# EAGLE design Coll-Interface (EAGLE 9.6.2)
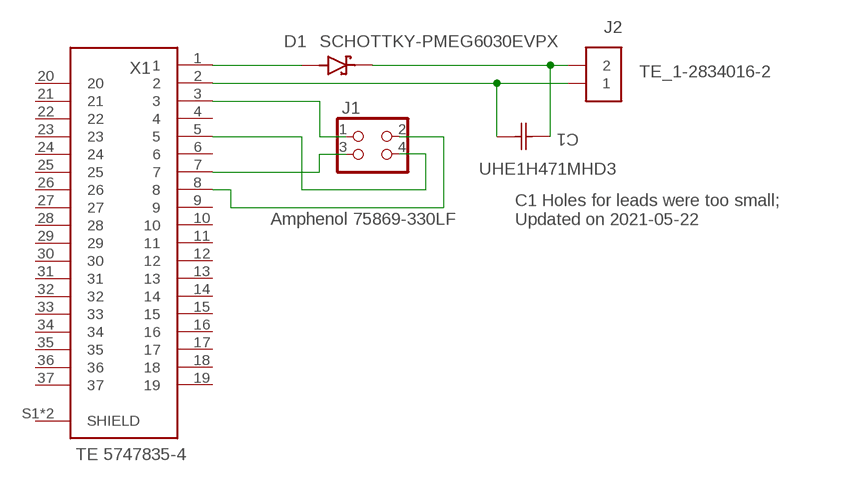
[diagram p0: schematic, sheet 1]

## Parts
C1  UHE1H471MHD3  ELECTROLYTIC_UHE1H471MHD3  [U1-EE_NCH]
D1  SCHOTTKY-PMEG6030EVPX  [DIO_PMEG6030EVPX]
J1  Amphenol 75869-330LF  PINHD-2X2AMP-75869-130LF  [2X02-SHROUD]
J2  TE_1-2834016-2  TERMINAL_BLOCK_2PIN_1-2834016-2  [TE_1-2834016-2]
X1  TE 5747835-4  DE-37-TE-CONNECTIVITY-5747835-4  [TE_5747835-4]

## Nets
+24V-FROM-SPECMECH: D1.2(A) X1.1
+24V-TO-ROBOCLAW: C1.1 D1.1(K) J2.2.1 J2.2.2
GND-ROBOCLAW: C1.2 J2.1.1 J2.1.2 X1.2
GND-SPECMECH: J1.4 X1.5
ROBO-RX: J1.1 X1.3
ROBO-TX: J1.3 X1.7
VCC-SPECMECH: J1.2 X1.8
Unconnected: X1.4 X1.6 X1.9 X1.10 X1.11 X1.12 X1.13 X1.14 X1.15 X1.16 X1.17 X1.18 X1.19 X1.20 X1.21 X1.22 X1.23 X1.24 X1.25 X1.26 X1.27 X1.28 X1.29 X1.30 X1.31 X1.32 X1.33 X1.34 X1.35 X1.36 X1.37 X1.S1(SHIELD) X1.S2(SHIELD)

## Notes on the sheet
- C1 Holes for leads were too small;
  Updated on 2021-05-22

## Library data of the parts
C1 = AUmlib:ELECTROLYTIC_UHE1H471MHD3; BUILT_BY: EMA_UL_Team; MANUFACTURER_PART_NUMBER: UHE1H471MHD3; SOURCELIBRARY: Nichicon_2014-12-31; VENDOR: Nichicon
D1 = AUmlib:SCHOTTKY-PMEG6030EVPX: PMEG6030 Series 60 V 3 A Surface Mount Schottky Barrier Rectifier - SOD-128; DESCRIPTION: Diode Schottky 60V 3A Surface Mount SOD-128/CFP5; DIGI-KEY_PART_NUMBER: 1727-1349-1-ND; MF: Nexperia USA; MP: PMEG6030EVPX; PACKAGE: CFP5-2 Nexperia USA Inc.; PURCHASE-URL: https://pricing.snapeda.com/search/part/PMEG6030EVPX/?ref=eda
J1 = AUmlib:PINHD-2X2: PIN HEADER
J2 = AUmlib:TERMINAL_BLOCK_2PIN_1-2834016-2: PCB Terminal Blocks, Receptacle, Wire-to-Board, 2 Positions, 1 Rows, Side Wire Entry Angle, 26 – 20AWG Wire Size, 6A Current Rating (Max), 300 VAC; COMMENT: 1-2834016-2; DESCRIPTION: Conn PC Terminal Block 2 POS 2.54mm Solder ST Thru-Hole 6A/Contact Box/Carton; DIGI-KEY_PART_NUMBER: A123829-ND; EU_ROHS_COMPLIANCE: Compliant; MF: TE Connectivity; MP: 1-2834016-2; PACKAGE: None; PURCHASE-URL: https://pricing.snapeda.com/search/part/1-2834016-2/?ref=eda
X1 = AUmlib:DE-37-TE-CONNECTIVITY-5747835-4: 37 MSFL PLUG RA 590 (IN,FM,BL); CENTERLINE_PITCH: 2.74 mm[.108 in]; COMMENT: 5747835-4; DESCRIPTION: 37 MSFL PLUG RA 590 (IN,FM,BL); DIGI-KEY_PART_NUMBER: A32082-ND; MF: TE Connectivity; MP: 5747835-4; NUMBER_OF_POSITIONS: 37; PACKAGE: None; PRODUCT_TYPE: Connector; PURCHASE-URL: https://pricing.snapeda.com/search/part/5747835-4/?ref=eda

## Board
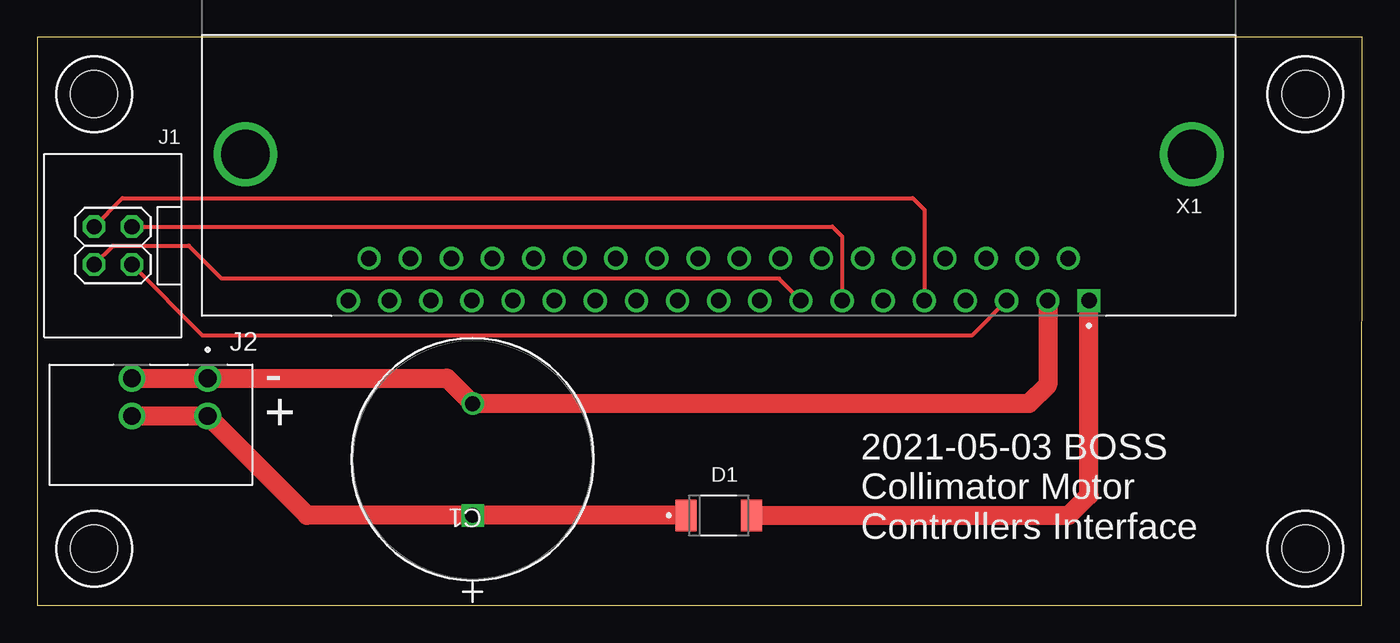
[diagram p1: board, top side]
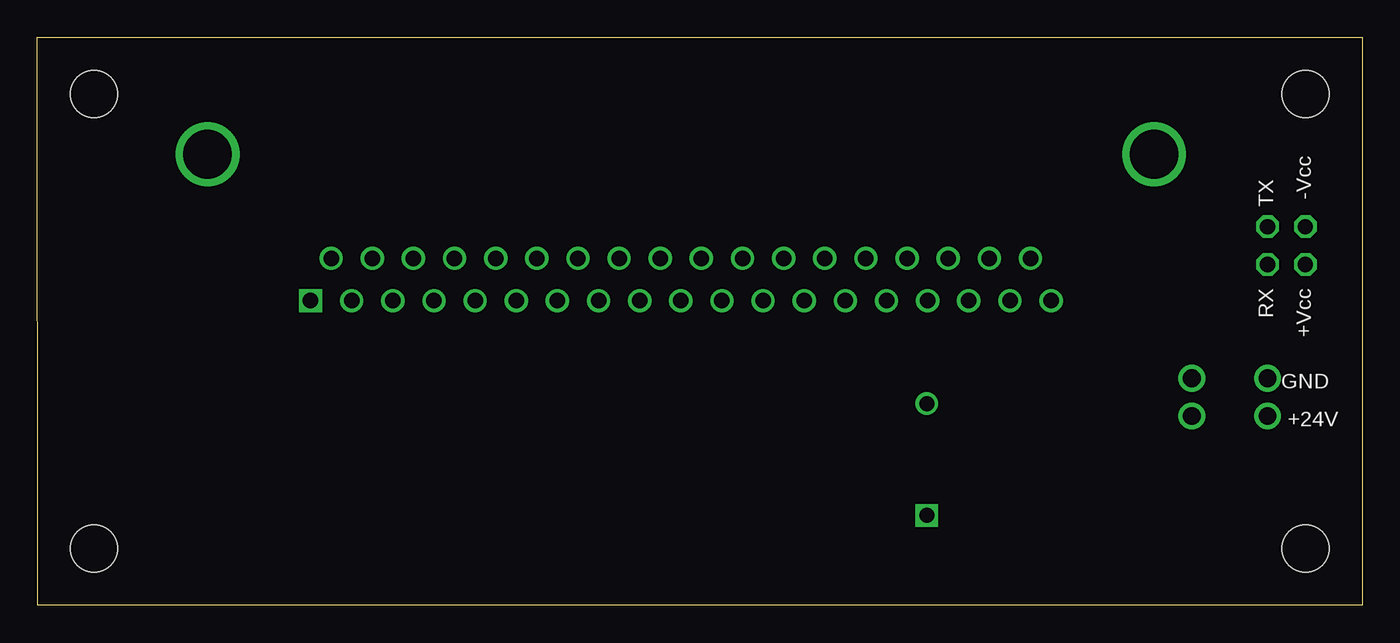
[diagram p2: board, bottom side, seen from below]

Size 88.9 x 38.1 mm. Coordinates in mm from the lower left corner, seen from the top.
Outline: 0,0 88.88,0 88.9,38.1 0,38.1 0,0
Copper layers (1*16): Top 0.035mm / dielectric 1.5mm / Bottom 0.035mm
Design rules "default": minimum track width 6mil, minimum drill 0.35mm, track to track 6mil, track to pad 6mil, pad to pad 6mil, via to via 6mil, smd to smd 6mil, copper to edge 40mil, drill to drill 6mil, minimum pad ring 10mil, minimum via ring 8mil, stop-mask expansion 4mil, vias tented up to drill 0mil, thermal gap 10mil
Holes 3.17 mm at 3.81,3.81 3.81,34.29 85.09,34.29 85.09,3.81

### Footprints (pad centres in the part's own frame; a part is rotated, then mirrored left to right if it is on the bottom)
U1-EE_NCH = drill 1 pad 1.5 square: 1 0,0 | drill 1 pad 1.5: 2 7.493,0
DIO_PMEG6030EVPX = smd 1.4 x 2.1: 1 -2.2,0; 2 2.2,0
2X02-SHROUD = drill 1.016 octagon: 1 -1.27,-1.27; 2 -1.27,1.27; 3 1.27,-1.27; 4 1.27,1.27
TE_1-2834016-2 = drill 1.2: 1.1 0,0; 1.2 0,-5.08; 2.1 2.54,0; 2.2 2.54,-5.08
TE_5747835-4 = drill 1.04 square: 1 -24.84,11.315 | drill 1.04: 2 -22.08,11.315; 3 -19.32,11.315; 4 -16.56,11.315; 5 -13.8,11.315; 6 -11.04,11.315; 7 -8.28,11.315; 8 -5.52,11.315; 9 -2.76,11.315; 10 0,11.315; 11 2.76,11.315; 12 5.52,11.315; 13 8.28,11.315; 14 11.04,11.315; 15 13.8,11.315; 16 16.56,11.315; 17 19.32,11.315; 18 22.08,11.315; 19 24.84,11.315; 20 -23.461,8.475; 21 -20.701,8.475; 22 -17.941,8.475; 23 -15.181,8.475; 24 -12.421,8.475; 25 -9.661,8.475; 26 -6.901,8.475; 27 -4.141,8.475; 28 -1.381,8.475; 29 1.379,8.475; 30 4.139,8.475; 31 6.899,8.475; 32 9.659,8.475; 33 12.419,8.475; 34 15.179,8.475; 35 17.939,8.475; 36 20.699,8.475; 37 23.459,8.475 | drill 3.26: S1 -31.75,1.495; S2 31.75,1.495

### Placement (x,y rotation side)
C1  29.21,6.03 90 top
D1  45.72,6.03 0 top
J1  5.08,24.13 90 top
J2  11.43,15.24 270 top
X1  45.72,31.75 180 top

### Tracks (layer width: path | path; a pad name or v marks a point on that pad's centre or on a via)
+24V-FROM-SPECMECH
  Top 1.27: D1.2 69.22,6.03 70.56,7.38 X1.1
+24V-TO-ROBOCLAW
  Top 1.27: J2.2.2 J2.2.1 18.1,6.03 C1.1 D1.1
GND-ROBOCLAW
  Top 1.27: J2.1.2 J2.1.1 27.5,15.24 C1.2 66.55,13.53 67.8,14.78 X1.2
GND-SPECMECH
  Top 0.254: J1.4 5.71,27.3 58.74,27.3 59.53,26.52 X1.5
ROBO-RX
  Top 0.254: J1.1 11.11,18.1 62.7,18.1 X1.3
ROBO-TX
  Top 0.254: J1.3 53.34,25.4 54,24.74 X1.7
VCC-SPECMECH
  Top 0.254: J1.2 5.08,24.13 10.16,24.13 12.38,21.91 49.77,21.91 X1.8

### Text on the board
tPlace: - | + | 2021-05-03 BOSS / Collimator Motor / Controllers Interface
bPlace: -Vcc | TX | +Vcc | RX | GND | +24V